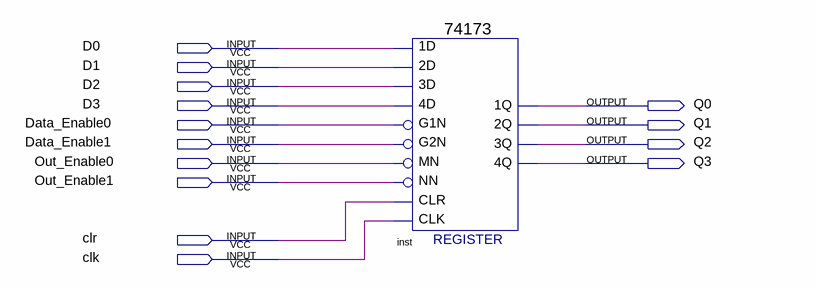
[diagram p0: schematic sheet]
// Quartus schematic register_4bit.bdf as structural Verilog: 1 symbols, 14 pins
module register_4bit (
  input  D0,
  input  D1,
  input  D2,
  input  D3,
  input  Data_Enable0,
  input  Data_Enable1,
  input  Out_Enable0,
  input  Out_Enable1,
  input  clr,
  input  clk,
  output Q0,
  output Q1,
  output Q2,
  output Q3
);

  \74173  inst (
    .\3D (D2), .MN(Out_Enable0), .\1D (D0), .\2D (D1), .\4D (D3), .G1N(Data_Enable0), .G2N(Data_Enable1),
    .NN(Out_Enable1), .CLR(clr), .CLK(clk), .\3Q (Q2), .\2Q (Q1), .\1Q (Q0), .\4Q (Q3));
endmodule
